# Altium project XPIRL_IR_1V0.PrjPCB
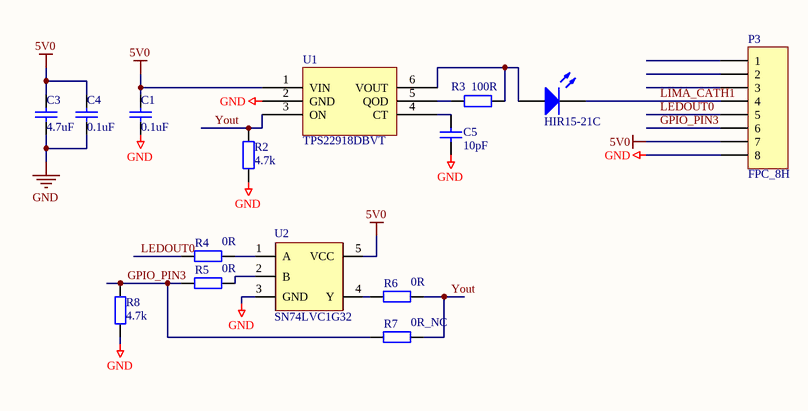
[diagram p0: sch_Camera.SchDoc]
1 sheet, 15 parts. Net scope: global (net labels, ports and power ports of the same name join across sheets).

## Sheet sch_Camera.SchDoc
size A4

### Parts
C1  0.1uF  [0603C_N]
C3  4.7uF  [0603R_N]
C4  0.1uF  [0603C_N]
C5  10pF  [0603C_N]
HIR15-21C  LIMA  [1206R]  (value not drawn)
P3  FPC_8H  [FPC_8H]
R2  4.7k  [0603R_N]
R3  100R  [0603R_N]
R4  0R  [0603R_N]
R5  0R  [0603R_N]
R6  0R  [0603R_N]
R7  0R_NC  [0603R_N]
R8  4.7k  [0603R_N]
U1  TPS22918DBVT  [SOT23-6_P0.95X2.4_L3W4.2H1.1]
U2  SN74LVC1G32  [SOT23-5_P0.95X2.4_L3W4.2H1.1]

### Nets
5V0: C1.2 C3.2 C4.2 P3.7 U1.1(VIN) U2.5(VCC)
GND: C1.1 C3.1 C4.1 C5.1 P3.8 R2.1 R8.1 U1.2(GND) U2.3(GND)
GPIO_PIN3: P3.6 R5.2 R7.2 R8.2
LEDOUT0: P3.5 R4.2
LIMA_CATH1: HIR15-21C.2(K) P3.4
Yout: R2.2 R6.1 R7.1 U1.3(ON)
NetC5_2: C5.2 U1.4(CT)
NetHIR15-21C_1: HIR15-21C.1(A) R3.1 U1.6(VOUT)
NetR3_2: R3.2 U1.5(QOD)
NetR4_1: R4.1 U2.1(A)
NetR5_1: R5.1 U2.2(B)
NetR6_2: R6.2 U2.4(Y)

Not connected (* = marked no-connect by the designer): P3 1 2 3

### Library data of the parts
C1 C5 = Cap: Capacitor; Published: 8-Jun-2000; LatestRevisionDate: 17-Jul-2002; LatestRevisionNote: Re-released for DXP Platform.; Publisher: Altium Limited
  C1: Value: 0.1uF
  C5: Value: 10pF
C3 = Cap: Capacitor; Value: 0805; Published: 8-Jun-2000; LatestRevisionDate: 17-Jul-2002; LatestRevisionNote: Re-released for DXP Platform.; PackageReference: RAD-0.3; Publisher: Altium Limited
C4 = Cap: Capacitor; Value: C0402; Published: 8-Jun-2000; LatestRevisionDate: 17-Jul-2002; LatestRevisionNote: Re-released for DXP Platform.; Publisher: Altium Limited
HIR15-21C = LED: 发光二级管
P3 = Header 8H: Header, 8-Pin, Right Angle; LatestRevisionDate: 17-Jul-2002; LatestRevisionNote: Re-released for DXP Platform.; Publisher: Altium Limited
R2-R8 = Resistor: Value: 100; Published: 8-Jun-2000; LatestRevisionDate: 17-Jul-2002; LatestRevisionNote: Re-released for DXP Platform.; PackageReference: AXIAL-0.4; Publisher: Altium Limited